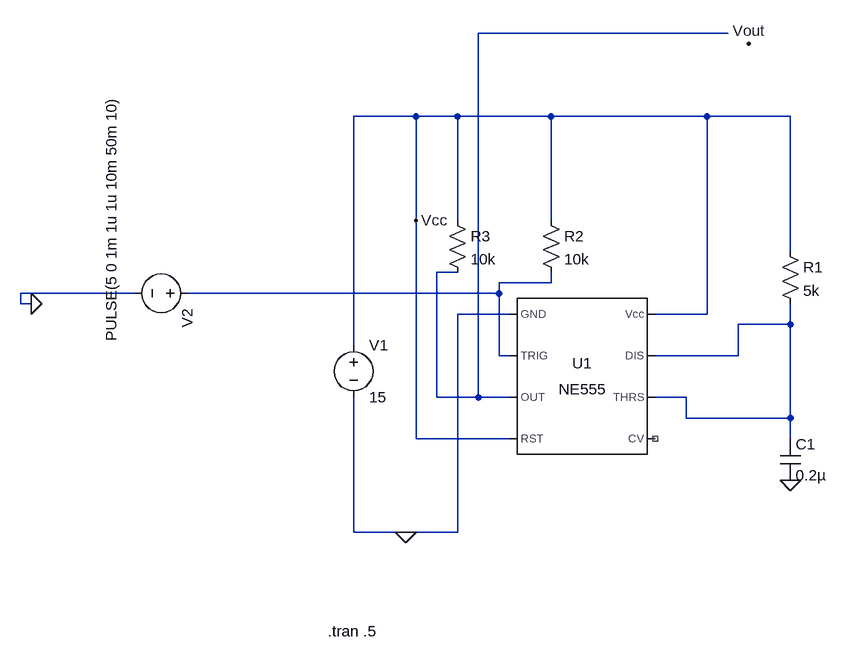
[diagram p0: schematic Q3_MONOSTABLE.asc]
Q3_MONOSTABLE.asc, the LTspice schematic file:
Version 4.1
SHEET 1 880 680
WIRE 640 -704 256 -704
WIRE 160 -576 64 -576
WIRE 224 -576 160 -576
WIRE 368 -576 224 -576
WIRE 608 -576 368 -576
WIRE 736 -576 608 -576
WIRE 160 -416 160 -576
WIRE 224 -416 224 -576
WIRE 368 -416 368 -576
WIRE 736 -368 736 -576
WIRE 224 -336 192 -336
WIRE 368 -320 368 -336
WIRE 368 -320 288 -320
WIRE -272 -304 -448 -304
WIRE 288 -304 288 -320
WIRE 288 -304 -192 -304
WIRE -448 -288 -448 -304
WIRE -432 -288 -448 -288
WIRE 304 -272 224 -272
WIRE 608 -272 608 -576
WIRE 608 -272 528 -272
WIRE 736 -256 736 -288
WIRE 736 -256 656 -256
WIRE 64 -224 64 -576
WIRE 288 -208 288 -304
WIRE 304 -208 288 -208
WIRE 656 -208 656 -256
WIRE 656 -208 528 -208
WIRE 192 -144 192 -336
WIRE 256 -144 256 -704
WIRE 256 -144 192 -144
WIRE 304 -144 256 -144
WIRE 576 -144 528 -144
WIRE 576 -112 576 -144
WIRE 736 -112 736 -256
WIRE 736 -112 576 -112
WIRE 160 -80 160 -416
WIRE 304 -80 160 -80
WIRE 736 -80 736 -112
WIRE 64 64 64 -144
WIRE 144 64 64 64
WIRE 224 64 224 -272
WIRE 224 64 144 64
FLAG 736 -16 0
FLAG 144 64 0
FLAG 160 -416 Vcc
FLAG 672 -688 Vout
FLAG -432 -288 0
SYMBOL Misc\\NE555 416 -176 R0
SYMATTR InstName U1
SYMBOL res 720 -384 R0
SYMATTR InstName R1
SYMATTR Value 5k
SYMBOL cap 720 -80 R0
SYMATTR InstName C1
SYMATTR Value 0.2µ
SYMBOL voltage 64 -240 R0
WINDOW 123 0 0 Left 0
WINDOW 39 0 0 Left 0
SYMATTR InstName V1
SYMATTR Value 15
SYMBOL res 208 -432 R0
SYMATTR InstName R3
SYMATTR Value 10k
SYMBOL res 352 -432 R0
SYMATTR InstName R2
SYMATTR Value 10k
SYMBOL voltage -176 -304 R90
WINDOW 3 -304 133 Left 2
WINDOW 123 0 0 Left 0
WINDOW 39 0 0 Left 0
SYMATTR Value PULSE(5 0 1m 1u 1u 10m 50m 10)
SYMATTR InstName V2
TEXT 24 216 Left 2 !.tran .5

The netlist it stands for:
* Q3_MONOSTABLE.asc
X§U1 0 N002 N001 Vcc NC_01 N003 N003 Vcc NE555  ; pins GND TRIG OUT RST CV THRS DIS Vcc
R1 Vcc N003 5k
C1 N003 0 0.2µ
V1 Vcc 0 15
R3 Vcc N001 10k
R2 Vcc N002 10k
V2 N002 0 PULSE(5 0 1m 1u 1u 10m 50m 10)
.tran .5
.lib NE555.sub
.backanno
.end